# Altium schematic sheet can-transceiver.SchDoc: SN65HVD233 Layout
size A4; DrawnBy: Dylan Vogel; Revision: 1.0
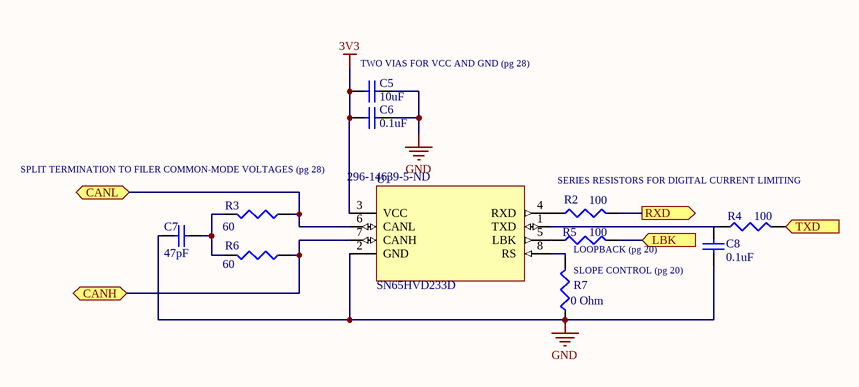
[diagram p0: can-transceiver.SchDoc]

## Parts
C5  value 10uF  [C1206]  (hidden comment: Cap Semi)
C6  value 0.1uF  [C1206]  (hidden comment: Cap Semi)
C7  value 47pF  [C1206]  (hidden comment: Cap Semi)
C8  value 0.1uF  [C1206]  (hidden comment: Cap Semi)
R2  value 100  [J1-0603]  (hidden comment: Res3)
R3  value 60  [J1-0603]  (hidden comment: Res3)
R4  value 100  [J1-0603]  (hidden comment: Res3)
R5  value 100  [J1-0603]  (hidden comment: Res3)
R6  value 60  [J1-0603]  (hidden comment: Res3)
R7  value 0 Ohm  [J1-0603]  (hidden comment: Res3)
U1  SN65HVD233D  Supplier Part Number 1: 296-14639-5-ND  [SOIC127P500X600-8N]

## Ports
CANH (bidir), CANL (bidir), LBK (in), RXD (out), TXD (in)

## Nets
3V3: C5.2 C6.2 U1.3(VCC)
GND: C5.1 C6.1 C7.1 C8.1 R7.1 U1.2(GND)
CANH: R6.1 U1.7(CANH) ; port CANH
CANL: R3.1 U1.6(CANL) ; port CANL
LBK: R5.2 ; port LBK
RXD: R2.2 ; port RXD
TXD: R4.2 ; port TXD
NetC7_2: C7.2 R3.2 R6.2
NetC8_2: C8.2 R4.1 U1.1(TXD)
NetR2_1: R2.1 U1.4(RXD)
NetR5_1: R5.1 U1.5(LBK)
NetR7_2: R7.2 U1.8(RS)

## Notes on the sheet
- (near C5) TWO VIAS FOR VCC AND GND (pg 28)
- SPLIT TERMINATION TO FILER COMMON-MODE VOLTAGES (pg 28)
- SERIES RESISTORS FOR DIGITAL CURRENT LIMITING
- (near R5) LOOPBACK (pg 20)
- (near R7) SLOPE CONTROL (pg 20)

## Library data of the parts
C5-C8 = Cap Semi: Capacitor (Semiconductor SIM Model); Published: 8-Jun-2000; LatestRevisionDate: 29-May-2009; LatestRevisionNote: IPC-7351 Footprint Added.; PackageReference: C1206; Publisher: Altium Limited; PackageDescription: Chip Capacitor
R2-R7 = Res3: Resistor; Published: 8-Jun-2000; LatestRevisionDate: 29-May-2009; LatestRevisionNote: IPC-7351 Footprint Added.; PackageReference: J1-0603; Publisher: Altium Limited; PackageDescription: Chip Resistor
U1 = SN65HVD233D: 3.3V CAN Transceiver with Standby Mode, Loop-back 8-SOIC -40 to 125; MF: Texas Instruments; MP: SN65HVD233D; Package: SOIC-8 Texas Instruments; Availability: Good; SnapEDA_Link: https://www.snapeda.com/parts/SN65HVD233D/Texas%20Instruments/view-part/?ref=snap; Price: 2.39 USD; Value: *; Supplier 1: Digi-Key